# Altium schematic sheet ScrollWheel.SchDoc
size Letter; Organization: Ploopy Corporation; Address1: 137-1140 Burnhamthorpe Road W; Address3: Ontario; DocumentNumber: 4; Revision: R1.007; SheetNumber: 4; SheetTotal: 5
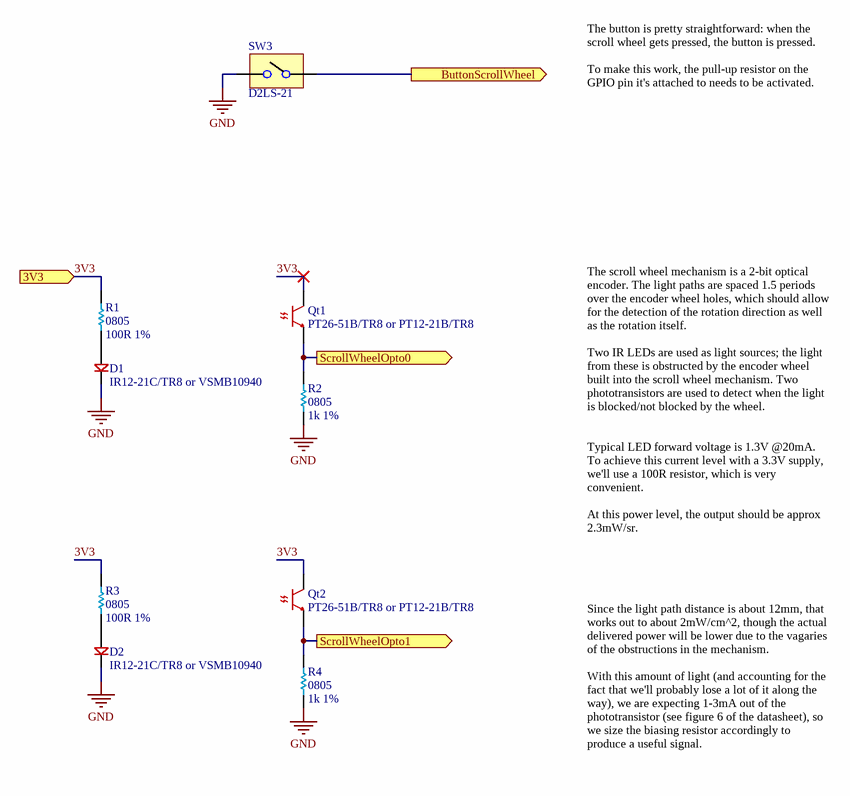
[diagram p0: ScrollWheel.SchDoc]

## Parts
D1  IR12-21C/TR8 or VSMB10940  [IR12-21C/TR8]
D2  IR12-21C/TR8 or VSMB10940  [IR12-21C/TR8]
Qt1  PT26-51B/TR8 or PT12-21B/TR8  [PT26-51B/TR8]
Qt2  PT26-51B/TR8 or PT12-21B/TR8  [PT26-51B/TR8]
R1  0805  value 100R 1%  [0805]
R2  0805  value 1k 1%  [0805]
R3  0805  value 100R 1%  [0805]
R4  0805  value 1k 1%  [0805]
SW3  D2LS-21  [D2LS-21]

## Ports
3V3 (in), ButtonScrollWheel (out), ScrollWheelOpto0 (out), ScrollWheelOpto1 (out)

## Nets
GND: D1.C D2.C R2.1 R4.1 SW3.B
3V3: Qt1.C Qt2.C R1.2 R3.2 ; port 3V3
ButtonScrollWheel: SW3.A ; port ButtonScrollWheel
ScrollWheelOpto0: Qt1.E R2.2 ; port ScrollWheelOpto0
ScrollWheelOpto1: Qt2.E R4.2 ; port ScrollWheelOpto1
NetD1_A: D1.A R1.1
NetD2_A: D2.A R3.1

## Notes on the sheet
- The button is pretty straightforward: when the scroll wheel gets pressed, the button is pressed.
  To make this work, the pull-up resistor on the GPIO pin it's attached to needs to be activated.
- The scroll wheel mechanism is a 2-bit optical encoder. The light paths are spaced 1.5 periods over the encoder wheel holes, which should allow for the detection of the rotation direction as well as the rotation itself.
  Two IR LEDs are used as light sources; the light from these is obstructed by the encoder wheel built into the scroll wheel mechanism. Two phototransistors are used to detect when the light is blocked/not blocked by the wheel.
  Typical LED forward voltage is 1.3V @20mA. To achieve this current level with a 3.3V supply, we'll use a 100R resistor, which is very convenient.
  At this power level, the output should be approx 2.3mW/sr.
  Since the light path distance is about 12mm, that works out to about 2mW/cm^2, though the actual delivered power will be lower due to the vagaries of the obstructions in the mechanism.
  With this amount of light (and accounting for the fact that we'll probably lose a lot of it along the way), we are expecting 1-3mA out of the phototransistor (see figure 6 of the datasheet), so we size the biasing resistor accordingly to produce a useful signal.
- Copyright Ploopy Corporation 2024
- Licensed under the CERN-OHL-S v2
- http://ohwr.org/cernohl
- Title:
- PCB:
- Version:
- Ploopy Corporation
- Mississauga ON L5C 0A3
- 137-1140 Burnhamthorpe Road W
- Date:
- Time:
- Sheet
- of
- Canada

## Library data of the parts
D1 D2 = IR12-21C/TR8: Infrared (IR) Emitter 880nm 1.3V 50mA 1mW/sr @ 20mA 30° 2-SMD, No Lead; Supplier 1: Digi-Key; Supplier 2: Mouser; Supplier 3: Digi-Key; Supplier 4: Mouser; Supplier 5: Arrow; Supplier Part Number 1: 1080-1351-1-ND; Supplier Part Number 2: 638-IR12-21C; Supplier Part Number 3: VSMB10940CT-ND; Supplier Part Number 4: 78-VSMB10940; Supplier Part Number 5: VSMB10940
Qt1 Qt2 = PT26-51B/TR8: Phototransistor 940nm Side View 1206 (3216 Metric); Supplier 1: Digi-Key; Supplier Part Number 1: 1080-1387-1-ND; Supplier 2: Digi-Key; Supplier Part Number 2: 1080-1377-1-ND
R1 R3 = Res 100R 1% 0805: Chip resistor; Supplier 1: Digi-Key; Supplier 2: Digi-Key; Supplier Part Number 1: RMCF0805FT100RCT-ND; Supplier Part Number 2: RMCF0805FT100RTR-ND
R2 R4 = Res 1k 1% 0805: Chip resistor, 1/8W 100PPM; Supplier 1: Digi-Key; Supplier Part Number 1: RMCF0805FT1K00TR-ND
SW3 = D2LS-21: Compact Surface-mounting Switch for long durability; Supplier 1: Digi-Key; Supplier 2: Mouser; Supplier Part Number 1: Z4378CT-ND; Supplier Part Number 2: 653-D2LS-21